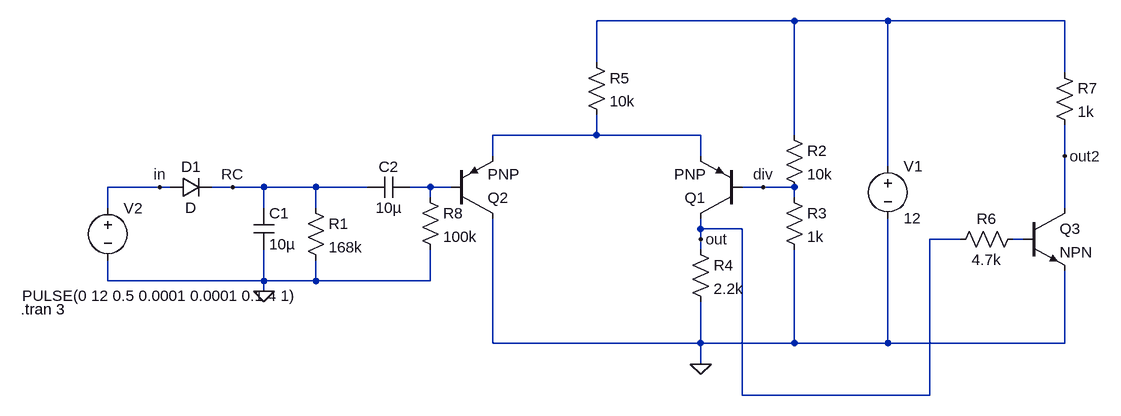
[diagram p0: schematic Mosfet_gate_ctrl.asc]
Mosfet_gate_ctrl.asc, the LTspice schematic file:
Version 4
SHEET 1 1624 680
WIRE 1136 -240 832 -240
WIRE 1280 -240 1136 -240
WIRE 1552 -240 1280 -240
WIRE 832 -176 832 -240
WIRE 1552 -160 1552 -240
WIRE 832 -64 832 -96
WIRE 832 -64 672 -64
WIRE 992 -64 832 -64
WIRE 1136 -64 1136 -240
WIRE 672 -32 672 -64
WIRE 992 -32 992 -64
WIRE 1552 -32 1552 -80
WIRE 1280 -16 1280 -240
WIRE 160 16 80 16
WIRE 176 16 160 16
WIRE 272 16 240 16
WIRE 320 16 272 16
WIRE 400 16 320 16
WIRE 480 16 400 16
WIRE 576 16 544 16
WIRE 608 16 576 16
WIRE 1088 16 1056 16
WIRE 1136 16 1088 16
WIRE 576 32 576 16
WIRE 1136 32 1136 16
WIRE 80 48 80 16
WIRE 320 48 320 16
WIRE 400 48 400 16
WIRE 1552 48 1552 -32
WIRE 992 80 992 64
WIRE 1056 80 992 80
WIRE 992 96 992 80
WIRE 1392 96 1344 96
WIRE 1488 96 1472 96
WIRE 992 112 992 96
WIRE 80 160 80 128
WIRE 320 160 320 112
WIRE 320 160 80 160
WIRE 400 160 400 128
WIRE 400 160 320 160
WIRE 576 160 576 112
WIRE 576 160 400 160
WIRE 320 176 320 160
WIRE 672 256 672 64
WIRE 992 256 992 192
WIRE 992 256 672 256
WIRE 1136 256 1136 112
WIRE 1136 256 992 256
WIRE 1280 256 1280 64
WIRE 1280 256 1136 256
WIRE 1552 256 1552 144
WIRE 1552 256 1280 256
WIRE 992 288 992 256
WIRE 1056 336 1056 80
WIRE 1344 336 1344 96
WIRE 1344 336 1056 336
FLAG 320 176 0
FLAG 160 16 in
FLAG 272 16 RC
FLAG 992 288 0
FLAG 1088 16 div
FLAG 992 96 out
FLAG 1552 -32 out2
SYMBOL diode 176 32 R270
WINDOW 0 32 32 VTop 2
WINDOW 3 0 32 VBottom 2
SYMATTR InstName D1
SYMBOL cap 304 48 R0
SYMATTR InstName C1
SYMATTR Value 10µ
SYMBOL res 384 32 R0
SYMATTR InstName R1
SYMATTR Value 168k
SYMBOL voltage 1280 -32 R0
WINDOW 123 0 0 Left 0
WINDOW 39 0 0 Left 0
SYMATTR InstName V1
SYMATTR Value 12
SYMBOL res 1120 -80 R0
SYMATTR InstName R2
SYMATTR Value 10k
SYMBOL res 1120 16 R0
SYMATTR InstName R3
SYMATTR Value 1k
SYMBOL voltage 80 32 R0
WINDOW 3 -132 151 Left 2
WINDOW 123 0 0 Left 0
WINDOW 39 0 0 Left 0
SYMATTR InstName V2
SYMATTR Value PULSE(0 12 0.5 0.0001 0.0001 0.1 4 1)
SYMBOL pnp 608 64 M180
SYMATTR InstName Q2
SYMBOL res 976 96 R0
SYMATTR InstName R4
SYMATTR Value 2.2k
SYMBOL pnp 1056 64 R180
SYMATTR InstName Q1
SYMBOL res 816 -192 R0
SYMATTR InstName R5
SYMATTR Value 10k
SYMBOL npn 1488 48 R0
SYMATTR InstName Q3
SYMBOL res 1488 80 R90
WINDOW 0 0 56 VBottom 2
WINDOW 3 32 56 VTop 2
SYMATTR InstName R6
SYMATTR Value 4.7k
SYMBOL res 1536 -176 R0
SYMATTR InstName R7
SYMATTR Value 1k
SYMBOL cap 544 0 R90
WINDOW 0 0 32 VBottom 2
WINDOW 3 32 32 VTop 2
SYMATTR InstName C2
SYMATTR Value 10µ
SYMBOL res 560 16 R0
SYMATTR InstName R8
SYMATTR Value 100k
TEXT -54 204 Left 2 !.tran 3

The netlist it stands for:
* Mosfet_gate_ctrl.asc
D1 in RC D
C1 RC 0 10µ
R1 RC 0 168k
V1 N001 0 12
R2 N001 div 10k
R3 div 0 1k
V2 in 0 PULSE(0 12 0.5 0.0001 0.0001 0.1 4 1)
Q2 0 N003 N002 0 PNP
R4 out 0 2.2k
Q1 out div N002 0 PNP
R5 N001 N002 10k
Q3 out2 N004 0 0 NPN
R6 N004 out 4.7k
R7 N001 out2 1k
C2 N003 RC 10µ
R8 N003 0 100k
.model D D
.lib standard.dio
.model NPN NPN
.model PNP PNP
.lib standard.bjt
.tran 3
.backanno
.end